# EAGLE design AD5330_Breakout (EAGLE 6.4)
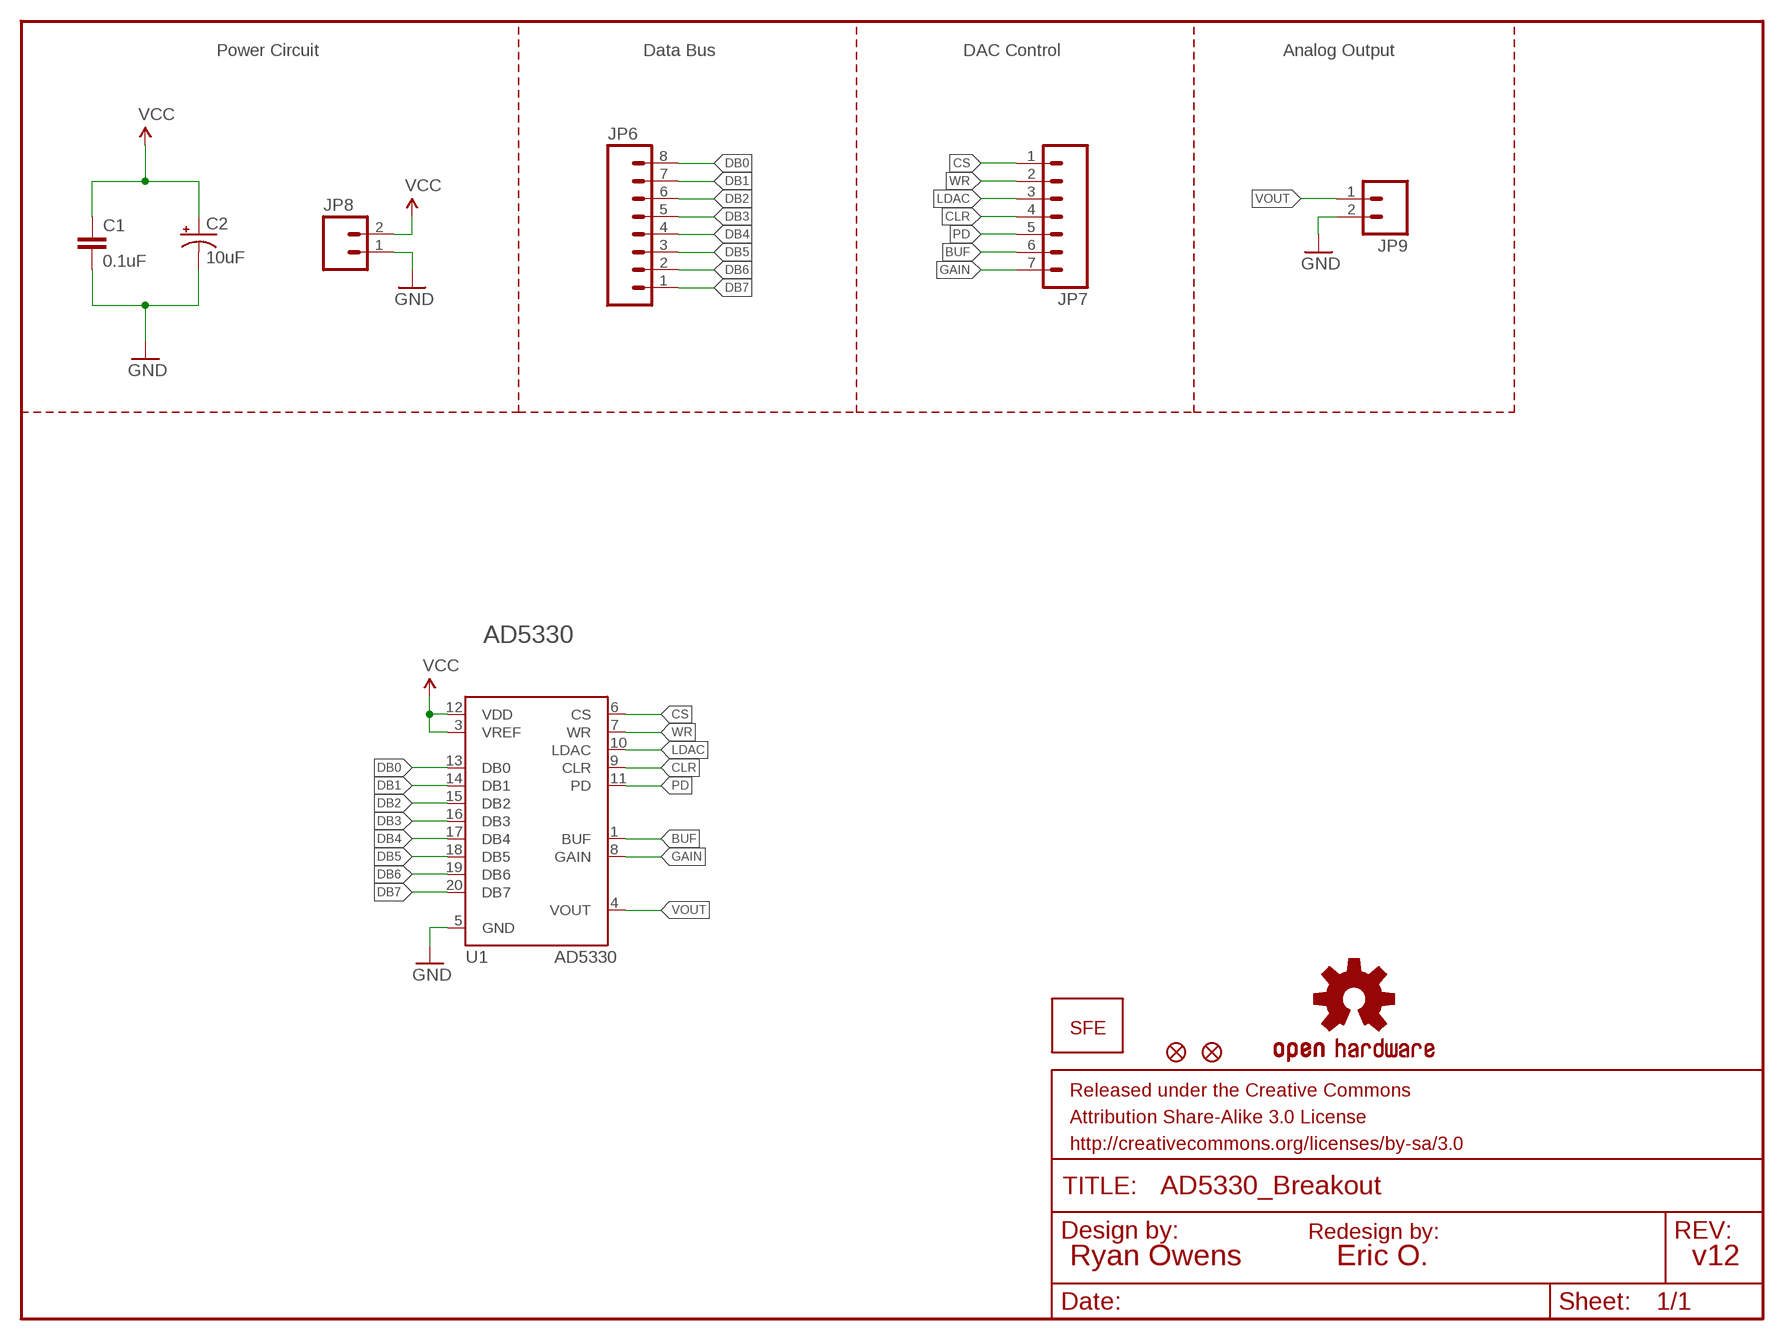
[diagram p0: schematic, sheet 1]

## Parts
C1  0.1uF  0.1UF-25V(+80/-20%)(0603)  [0603-CAP]
C2  10uF  10UF-16V-10%(TANT)  [EIA3216]
FRAME1  FRAME-LETTER  [CREATIVE_COMMONS]
JP1  LOGO-SFENEW  [SFE-NEW-WEBLOGO]
JP2  FIDUCIAL1X2  [FIDUCIAL-1X2]
JP3  FIDUCIAL1X2  [FIDUCIAL-1X2]
JP6  M08  [1X08]
JP7  M07  [1X07]
JP8  M02PTH  [1X02]
JP9  M02PTH  [1X02]
LOGO1  OSHW-LOGOS  [OSHW-LOGO-S]
U1  AD5330  [TSSOP20]

## Nets
BUF: JP7.6 U1.1(BUF)
CLR: JP7.4 U1.9(CLR)
CS: JP7.1 U1.6(CS)
DB0: JP6.8 U1.13(DB0)
DB1: JP6.7 U1.14(DB1)
DB2: JP6.6 U1.15(DB2)
DB3: JP6.5 U1.16(DB3)
DB4: JP6.4 U1.17(DB4)
DB5: JP6.3 U1.18(DB5)
DB6: JP6.2 U1.19(DB6)
DB7: JP6.1 U1.20(DB7)
GAIN: JP7.7 U1.8(GAIN)
GND: C1.2 C2.C(-) JP8.1 JP9.2 U1.5(GND)
LDAC: JP7.3 U1.10(LDAC)
PD: JP7.5 U1.11(PD)
VCC: C1.1 C2.A(+) JP8.2 U1.3(VREF) U1.12(VDD)
VOUT: JP9.1 U1.4(VOUT)
WR: JP7.2 U1.7(WR)

## Notes on the sheet
- Power Circuit | Data Bus | DAC Control | Analog Output
- AD5330
- Redesign by:
- Ryan Owens | Eric O. | v12

## Library data of the parts
C1 = SparkFun-Capacitors:0.1UF-25V(+80/-20%)(0603): Ceramic Standard decoupling cap CAP-00810; PROD_ID: CAP-00810
C2 = SparkFun-Capacitors:10UF-16V-10%(TANT): CAP-00811 1206/EIA-3216 Tantalum capacitor; PROD_ID: CAP-00811
FRAME1 = SparkFun-Aesthetics:FRAME-LETTER: Schematic Frame Standard 8.5x11 US Letter frame
JP1 = SparkFun:LOGO-SFE: Spark Fun Electronics PCB Logo This is the standard Spark Fun Electronics PCB logo.
JP2 JP3 = SparkFun:FIDUCIAL: Fiducial Alignment Points Various fiducial points for machine vision alignment.
JP6 = SparkFun:M08: Header 8 Standard 8-pin 0.1" header. Use with straight break away headers (SKU : PRT-00116), right angle break away headers (PRT-00553), swiss pins (PRT-00743), machine pins (PRT-00117), and female headers (PRT-00115).
JP7 = SparkFun:M07: Header 7 Standard 7-pin 0.1" header. Use with straight break away headers (SKU : PRT-00116), right angle break away headers (PRT-00553), swiss pins (PRT-00743), machine pins (PRT-00117), and female headers (PRT-00115). NOTES ON THE VARIANTS LOCK and LOCK_LONGPADS... This footprint was designed to help hold the alignment of a through-hole component (i.e. 7-pin header) while soldering it into place. You may notice that each hole has been shifted either up or down by 0.005 of an inch from it's more standard position (which is usually a perfectly straight line). This slight alteration caused the pins (the squares in the middle) to touch the edges of the holes. Because they are alternating, it causes a "brace" to hold the header in place. 0.005 has proven to be the perfect amount of "off-center" position when using our standard breakaway headers. Although looks a little odd when you look at the bare footprint, once you have a header in there, the alteration is very hard to notice. Also, if you push a header all the way into place, it is covered up entirely on the bottom side. This idea of altering the position of holes to aid alignment will be further integrated into the Sparkfun Library for other footprints. It can help hold any component with 3 or more connection pins.
JP8 JP9 = SparkFun:M02: Header 2 Standard 2-pin 0.1" header. Use with straight break away headers (SKU : PRT-00116), right angle break away headers (PRT-00553), swiss pins (PRT-00743), machine pins (PRT-00117), and female headers (PRT-00115). Molex polarized connector foot print use with SKU : PRT-08233 with associated crimp pins and housings.
LOGO1 = SparkFun-Aesthetics:OSHW-LOGO: Open Source Hardware Logo This logo indicates the piece of hardware it is found on incorporates a OSHW license and/or adheres to the definition of open source hardware found here: http://freedomdefined.org/OSHW
U1 = SparkFun:AD5330

## Board
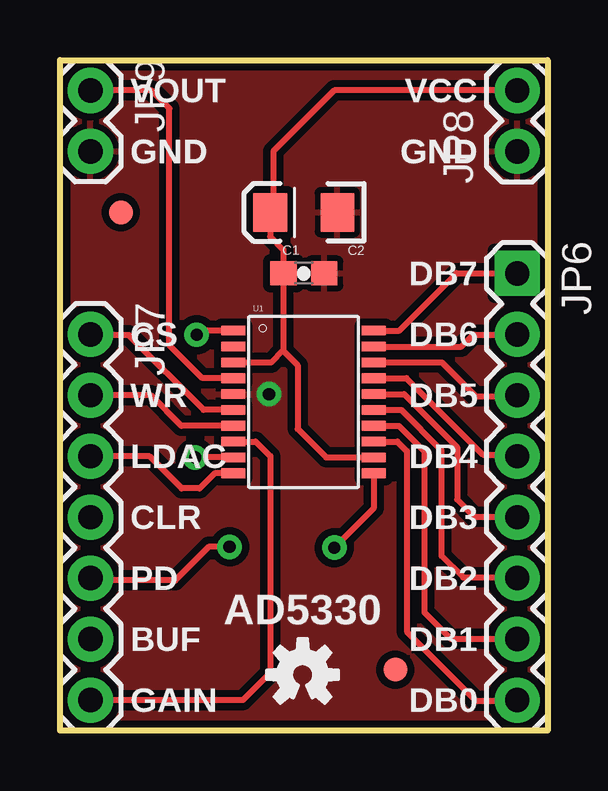
[diagram p1: board, top side]
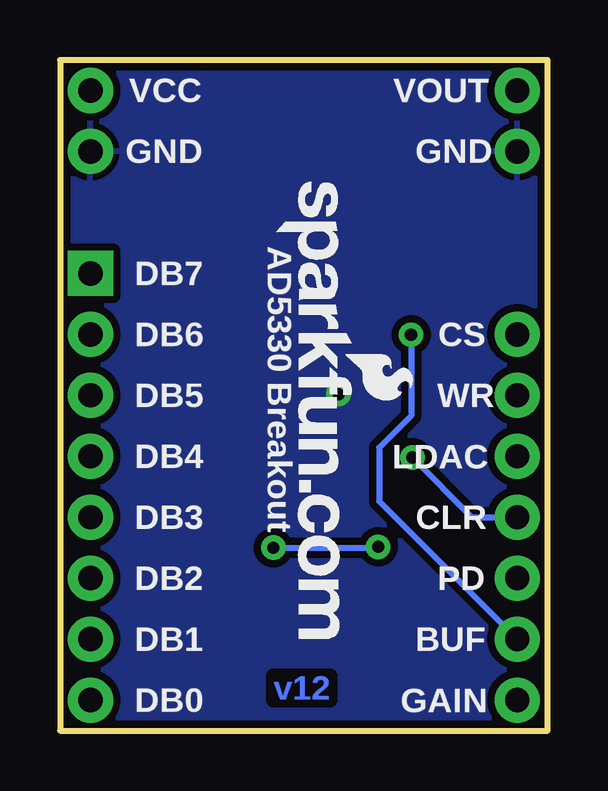
[diagram p2: board, bottom side, seen from below]

Size 20.32 x 27.94 mm. Coordinates in mm from the lower left corner, seen from the top.
Outline: 0,0 0,27.94 20.32,27.94 20.32,0 0,0
Copper layers (1*16): Top 0.035mm / dielectric 1.5mm / Bottom 0.035mm
Design rules "SparkFun *": minimum track width 8mil, minimum drill 20mil, track to track 8mil, track to pad 8mil, pad to pad 8mil, via to via 8mil, smd to smd 8mil, copper to edge 8mil, drill to drill 8mil, minimum pad ring 12mil, minimum via ring 10mil, stop-mask expansion 4mil, vias tented up to drill 20mil, thermal gap 10mil

### Footprints (pad centres in the part's own frame; a part is rotated, then mirrored left to right if it is on the bottom)
0603-CAP = smd 1.1 x 1: 1 -0.85,0; 2 0.85,0
EIA3216 = smd 1.4 x 1.6: A 1.4,0; C -1.4,0
FIDUCIAL-1X2 = smd 1 x 1: 1 0,0
1X08 = drill 1.016 pad 1.88 square: 1 0,0 | drill 1.016 pad 1.88: 2 2.54,0; 3 5.08,0; 4 7.62,0; 5 10.16,0; 6 12.7,0; 7 15.24,0; 8 17.78,0
1X07 = drill 1.016 pad 1.88: 1 0,0; 2 2.54,0; 3 5.08,0; 4 7.62,0; 5 10.16,0; 6 12.7,0; 7 15.24,0
1X02 = drill 1.016 pad 1.88: 1 0,0; 2 2.54,0
TSSOP20 = smd 1 x 0.4: 1 -2.937,2.693; 2 -2.937,2.032; 3 -2.937,1.372; 4 -2.937,0.712; 5 -2.937,0.051; 6 -2.937,-0.609; 7 -2.937,-1.27; 8 -2.943,-1.93; 9 -2.937,-2.59; 10 -2.937,-3.251; 11 2.905,-3.251; 12 2.905,-2.59; 13 2.911,-1.93; 14 2.905,-1.27; 15 2.905,-0.609; 16 2.905,0.051; 17 2.905,0.712; 18 2.905,1.372; 19 2.905,2.032; 20 2.905,2.693

### Placement (x,y rotation side)
C1  10.16,19.05 0 top
C2  10.16,21.59 180 top
FRAME1  -4.09,-13.97 0 top  (outside the outline)
JP1  11.3,22.86 270 bottom
JP2  2.54,21.59 0 top
JP3  13.97,2.54 0 top
JP6  19.05,19.05 270 top
JP7  1.27,16.51 270 top
JP8  19.05,24.13 90 top
JP9  1.27,26.67 270 top
LOGO1  10.11,2.33 0 top
U1  10.16,13.97 0 top

### Tracks (layer width: path | path; a pad name or v marks a point on that pad's centre or on a via)
BUF  (via drill 0.51)
  Top 0.254: U1.1 5.86,16.66 v5.69,16.49
  Bottom 0.254: 1.28,3.8 JP7.6 7.02,9.56 7.02,11.79 5.69,13.11 v5.69,16.49
CLR  (via drill 0.51)
  Top 0.254: U1.9 v5.64,11.38 v5.63,11.37
  Bottom 0.254: v5.63,11.37 v5.63,11.36 3.16,8.89 JP7.4
CS
  Top 0.254: U1.6 5.98,13.36 2.87,16.47 1.31,16.47 JP7.1
DB0
  Top 0.254: U1.13 14.06,12.04 14.45,11.65 14.45,4.12 17.33,1.24 19.02,1.24 JP6.8
DB1
  Top 0.254: U1.14 14.12,12.7 15.19,11.63 15.19,4.92 16.28,3.83 19.04,3.83 JP6.7
DB2
  Top 0.254: U1.15 14.21,13.36 15.89,11.68 15.89,7.28 16.79,6.38 19.02,6.38 JP6.6
DB3
  Top 0.254: U1.16 14.34,14.02 16.55,11.81 16.55,9.63 17.26,8.92 19.02,8.92 JP6.5
DB4
  Top 0.254: U1.17 14.43,14.68 17.62,11.5 18.98,11.5 JP6.4
DB5
  Top 0.254: U1.18 15.91,15.34 17.32,13.94 19.02,13.94 JP6.3
DB6
  Top 0.254: U1.19 16.73,16 17.22,16.5 19.04,16.5 JP6.2
DB7
  Top 0.254: U1.20 14.14,16.66 16.53,19.05 JP6.1
GAIN
  Top 0.254: U1.8 8.15,12.04 8.76,11.43 8.76,2.41 7.62,1.27 JP7.7
GND  (via drill 0.51 pad 1.02)
  other vias: 8.71,14.02
  pour Bottom (isolate 0.305): 0,0 0,27.94 20.32,27.94 20.32,0
  pour Top (isolate 0.305): 0,0 0,27.94 20.32,27.94 20.32,0
LDAC
  Top 0.254: U1.10 6.44,10.72 5.81,10.09 5.07,10.09 3.74,11.43 JP7.3
PD  (via drill 0.51)
  Top 0.254: U1.11 13.06,9.26 v11.43,7.62 | v7.06,7.65 6.21,7.65 4.81,6.25 1.37,6.25 JP7.5
  Bottom 0.254: v11.43,7.62 7.1,7.62 v7.06,7.65
VCC
  Top 0.254: JP8.2 11.43,26.67 8.89,24.13 8.89,21.72 C2.A 8.76,20.59 9.31,20.04 C1.1 9.31,15.84 | 9.31,15.84 8.8,15.33 U1.3 | 9.31,15.84 9.31,15.82 9.9,15.22 9.9,12.57 11.09,11.38 U1.12
VOUT
  Top 0.254: U1.4 5.93,14.68 4.56,16.05 4.56,25.92 3.81,26.67 JP9.1
WR
  Top 0.254: U1.7 5.06,12.7 3.79,13.96 JP7.2

### Text on the board
Bottom: v12
tPlace: VCC | VOUT | GND | GND | GND | GND | DB7 | DB6 | CS | DB5 | WR | DB4 | LDAC | DB3 | CLR | DB2 | PD | AD5330 | DB1 | BUF | DB0 | GAIN
bPlace: VCC | VOUT | GND | GND | AD5330 Breakout | DB7 | DB6 | CS | DB5 | WR | DB4 | LDAC | DB3 | CLR | DB2 | PD | DB1 | BUF | DB0 | GAIN